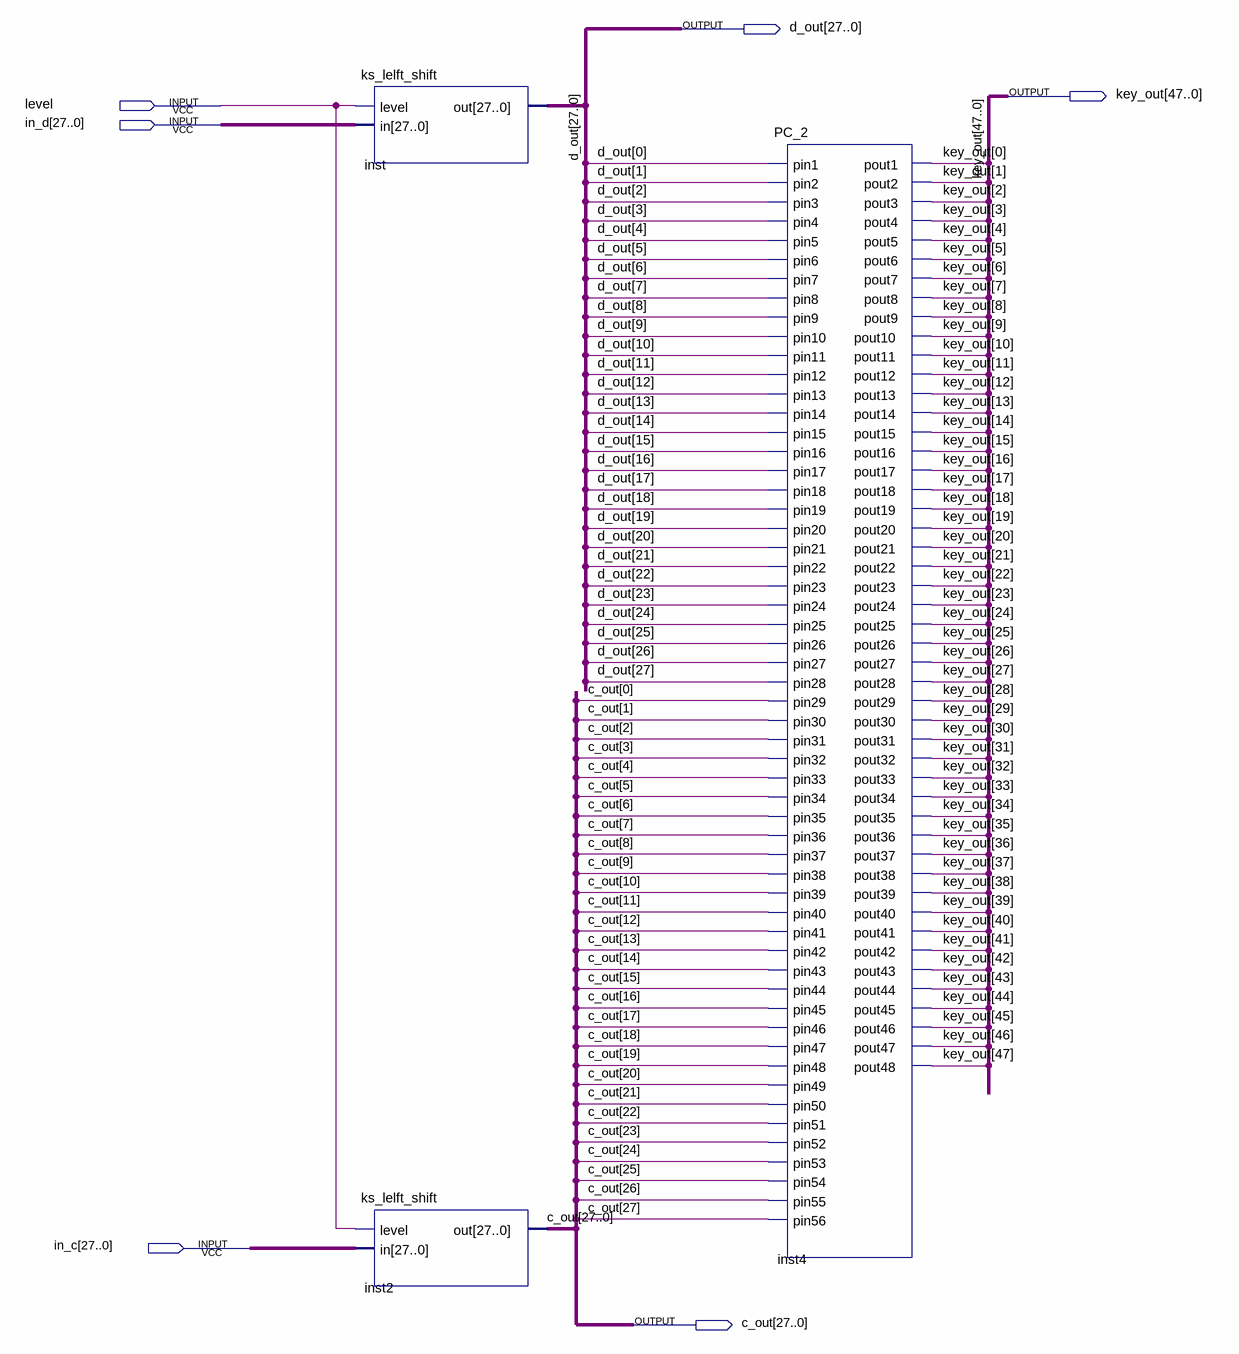
[diagram p0: schematic sheet]
// Quartus schematic round_key.bdf as structural Verilog: 3 symbols, 6 pins
module round_key (
  input  level,
  input  [27:0] in_d,
  input  [27:0] in_c,
  output [27:0] d_out,
  output [47:0] key_out,
  output [27:0] c_out
);

  ks_lelft_shift inst (.level(level), .in(in_d), .out(d_out));
  ks_lelft_shift inst2 (.level(level), .in(in_c), .out(c_out));
  PC_2 inst4 (
    .pin1(d_out[0]), .pin2(d_out[1]), .pin3(d_out[2]), .pin4(d_out[3]), .pin5(d_out[4]), .pin6(d_out[5]),
    .pin7(d_out[6]), .pin8(d_out[7]), .pin9(d_out[8]), .pin10(d_out[9]), .pin11(d_out[10]),
    .pin12(d_out[11]), .pin13(d_out[12]), .pin14(d_out[13]), .pin15(d_out[14]), .pin16(d_out[15]),
    .pin17(d_out[16]), .pin18(d_out[17]), .pin19(d_out[18]), .pin20(d_out[19]), .pin21(d_out[20]),
    .pin22(d_out[21]), .pin23(d_out[22]), .pin24(d_out[23]), .pin25(d_out[24]), .pin26(d_out[25]),
    .pin27(d_out[26]), .pin28(d_out[27]), .pin29(c_out[0]), .pin30(c_out[1]), .pin31(c_out[2]),
    .pin32(c_out[3]), .pin33(c_out[4]), .pin34(c_out[5]), .pin35(c_out[6]), .pin36(c_out[7]),
    .pin37(c_out[8]), .pin38(c_out[9]), .pin39(c_out[10]), .pin40(c_out[11]), .pin41(c_out[12]),
    .pin42(c_out[13]), .pin43(c_out[14]), .pin44(c_out[15]), .pin45(c_out[16]), .pin46(c_out[17]),
    .pin47(c_out[18]), .pin48(c_out[19]), .pin49(c_out[20]), .pin50(c_out[21]), .pin51(c_out[22]),
    .pin52(c_out[23]), .pin53(c_out[24]), .pin54(c_out[25]), .pin55(c_out[26]), .pin56(c_out[27]),
    .pout1(key_out[0]), .pout2(key_out[1]), .pout3(key_out[2]), .pout4(key_out[3]), .pout5(key_out[4]),
    .pout6(key_out[5]), .pout7(key_out[6]), .pout8(key_out[7]), .pout9(key_out[8]), .pout10(key_out[9]),
    .pout11(key_out[10]), .pout12(key_out[11]), .pout13(key_out[12]), .pout14(key_out[13]),
    .pout15(key_out[14]), .pout16(key_out[15]), .pout17(key_out[16]), .pout18(key_out[17]),
    .pout19(key_out[18]), .pout20(key_out[19]), .pout21(key_out[20]), .pout22(key_out[21]),
    .pout23(key_out[22]), .pout24(key_out[23]), .pout25(key_out[24]), .pout26(key_out[25]),
    .pout27(key_out[26]), .pout28(key_out[27]), .pout29(key_out[28]), .pout30(key_out[29]),
    .pout31(key_out[30]), .pout32(key_out[31]), .pout33(key_out[32]), .pout34(key_out[33]),
    .pout35(key_out[34]), .pout36(key_out[35]), .pout37(key_out[36]), .pout38(key_out[37]),
    .pout39(key_out[38]), .pout40(key_out[39]), .pout41(key_out[40]), .pout42(key_out[41]),
    .pout43(key_out[42]), .pout44(key_out[43]), .pout45(key_out[44]), .pout46(key_out[45]),
    .pout47(key_out[46]), .pout48(key_out[47]));
endmodule
